# Altium schematic sheet Общая схем лист 1.SchDoc
size 420 x 297 mm; SheetNumber: 1; SheetTotal: 5
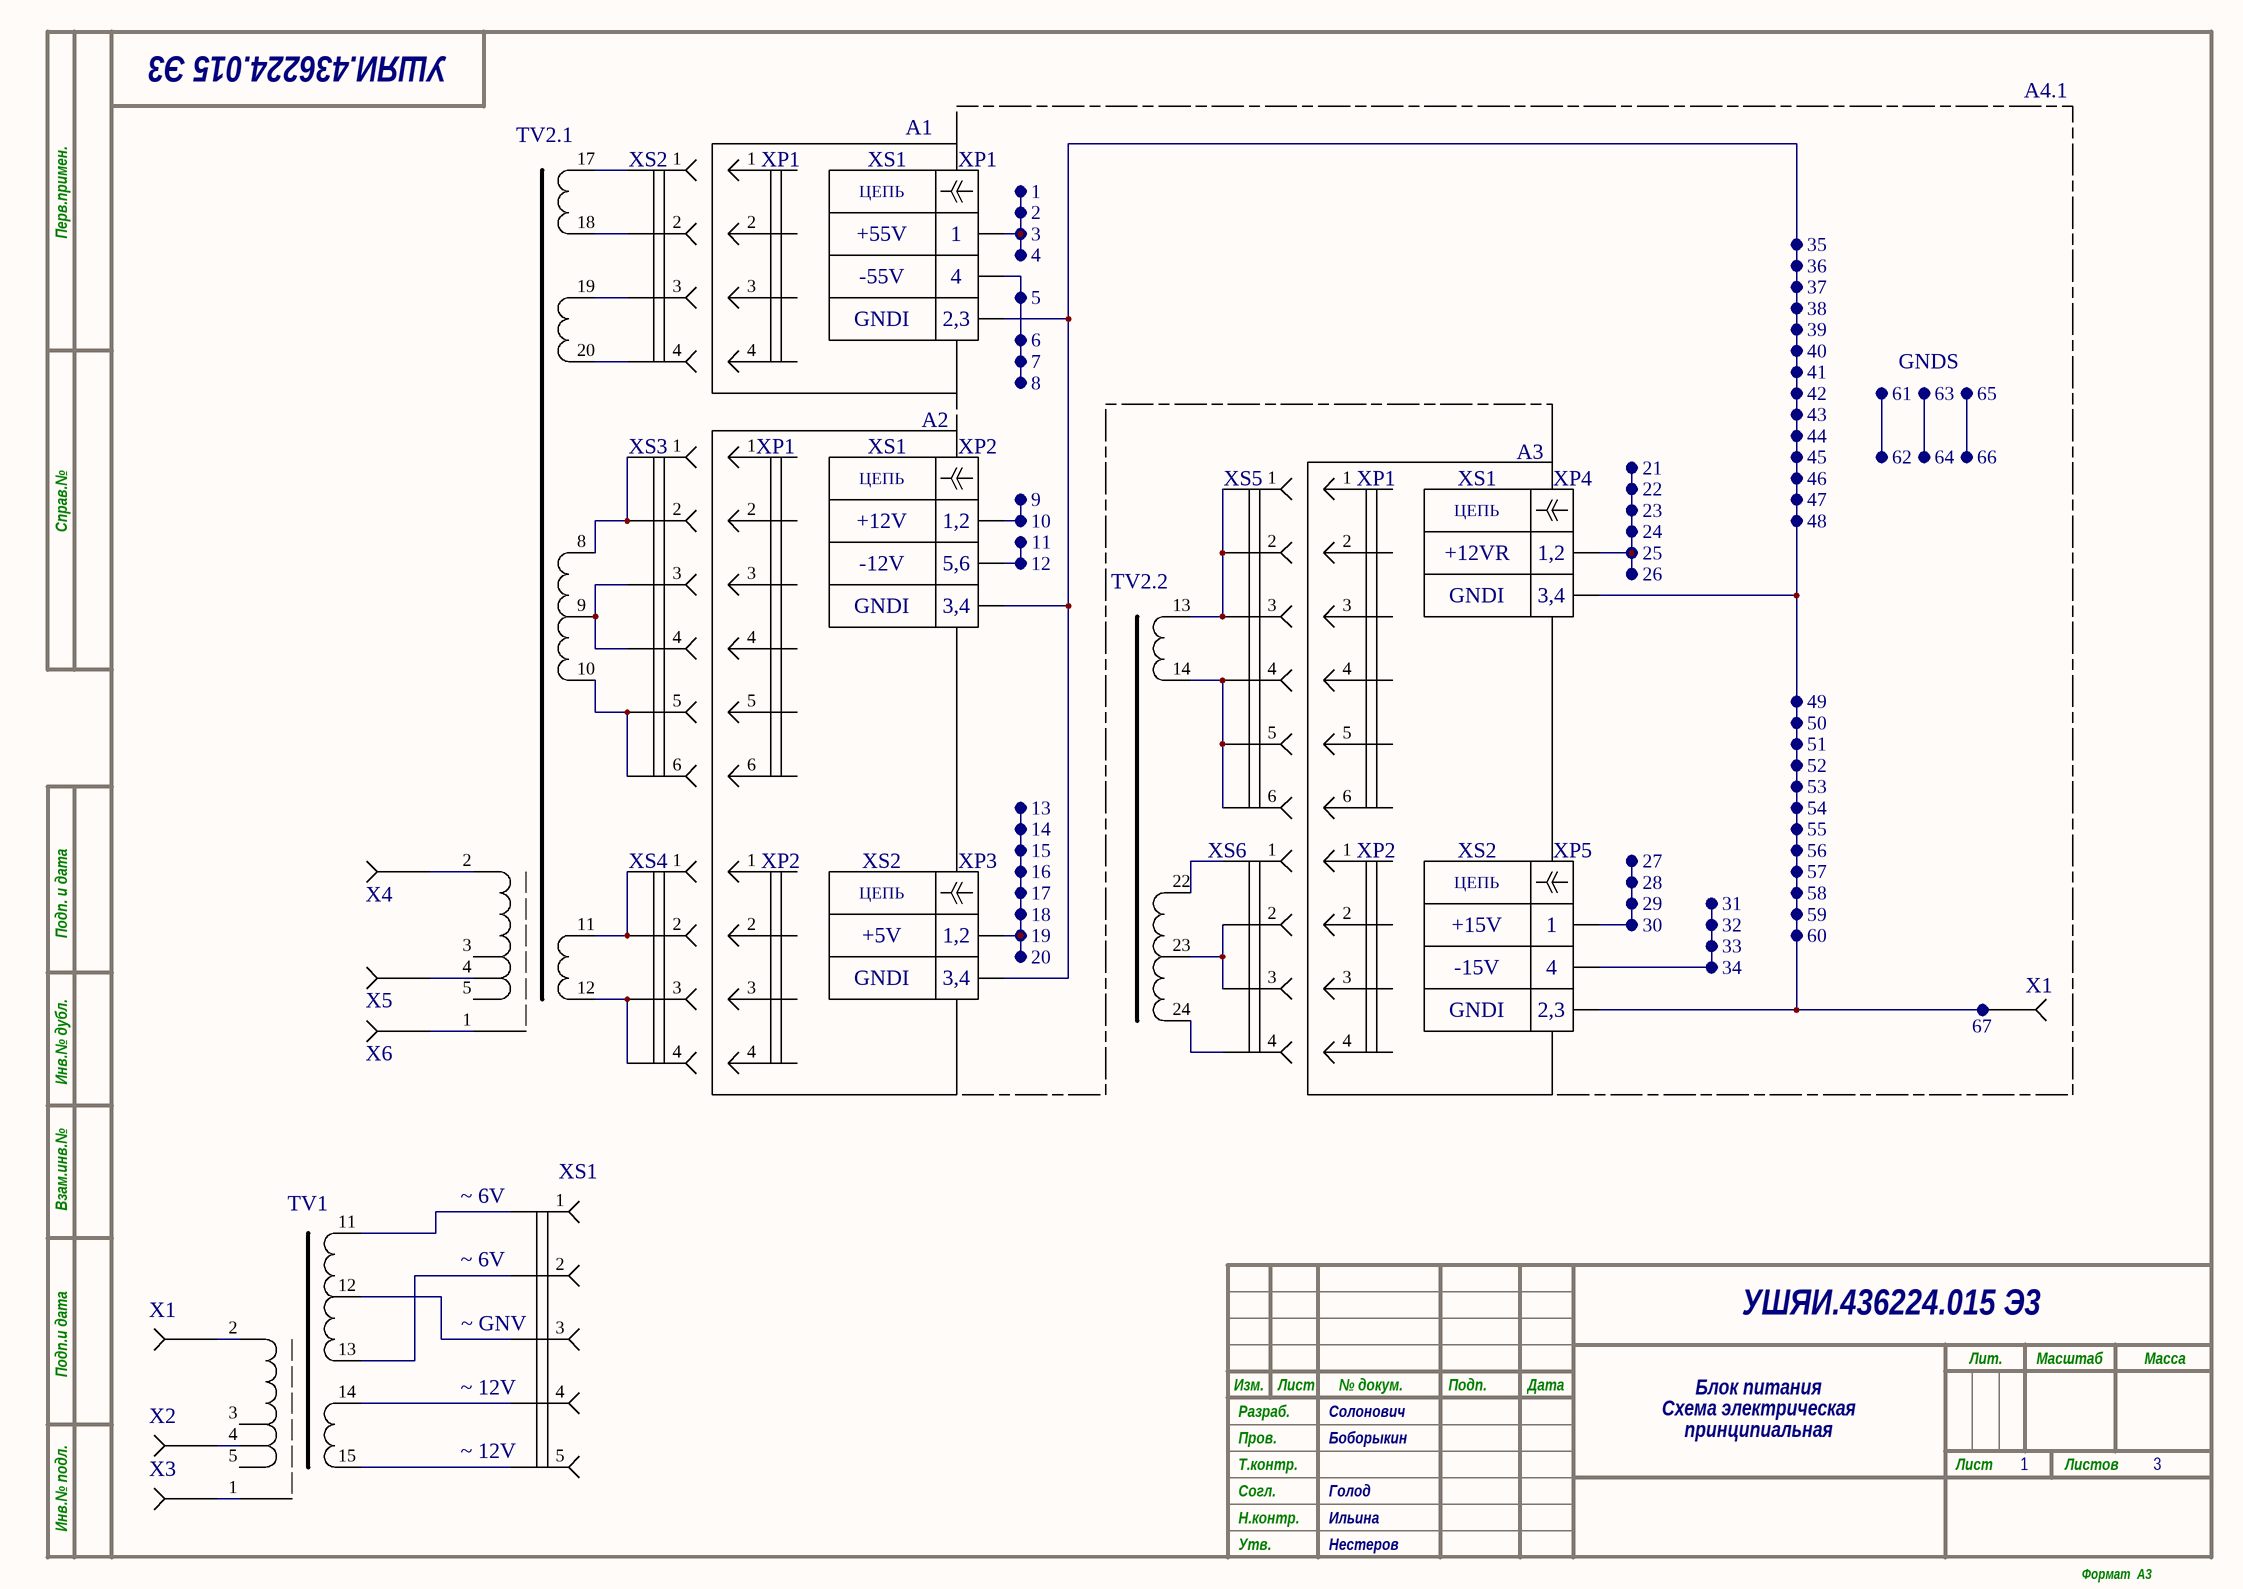
[diagram p0: Общая схем лист 1.SchDoc]

## Parts
(Parts that share a designator on the sheet are numbered #1, #2 ... from top to bottom, then left to right.)
TV1  Трансформатор 1  (value not drawn)
TV2.1  Трансформатор 2  (value not drawn)
TV2.2  Трансформатор 3  (value not drawn)
X1#1  Розетка 1 пин  (value not drawn)
X1#2  Розетка 1 пин  (value not drawn)
X2  Розетка 1 пин  (value not drawn)
X3  Розетка 1 пин  (value not drawn)
X4  Розетка 1 пин  (value not drawn)
X5  Розетка 1 пин  (value not drawn)
X6  Розетка 1 пин  (value not drawn)
XP1#1  Вилка 4 пин  (value not drawn)
XP1#2  Вилка 6 пин  (value not drawn)
XP1#3  Вилка 6 пин  (value not drawn)
XP2#1  Вилка 4 пин  (value not drawn)
XP2#2  Вилка 4 пин  (value not drawn)
XS1#1  +55V  (value not drawn)
XS1#2  +12V  (value not drawn)
XS1#3  +12VR  (value not drawn)
XS1#4  Розетка 1  (value not drawn)
XS2#1  Розетка 4 пин  (value not drawn)
XS2#2  +15V  (value not drawn)
XS2#3  +5V  (value not drawn)
XS3  Розетка 6 пин  (value not drawn)
XS4  Розетка 4 пин  (value not drawn)
XS5  Розетка 6 пин  (value not drawn)
XS6  Розетка 4 пин  (value not drawn)

## Nets
NetTV1_1: TV1.1 X3.1
NetTV1_2: TV1.2 X1#2.1
NetTV1_4: TV1.4 X2.1
NetTV1_11: TV1.11 XS1#4.1
NetTV1_12: TV1.12 XS1#4.3
NetTV1_13: TV1.13 XS1#4.2
NetTV1_14: TV1.14 XS1#4.4
NetTV1_15: TV1.15 XS1#4.5
NetTV2.1_1: TV2.1.1 X6.1
NetTV2.1_2: TV2.1.2 X4.1
NetTV2.1_4: TV2.1.4 X5.1
NetTV2.1_8: TV2.1.8 XS3.1 XS3.2
NetTV2.1_9: TV2.1.9 XS3.3 XS3.4
NetTV2.1_10: TV2.1.10 XS3.5 XS3.6
NetTV2.1_11: TV2.1.11 XS4.1 XS4.2
NetTV2.1_12: TV2.1.12 XS4.3 XS4.4
NetTV2.1_17: TV2.1.17 XS2#1.1
NetTV2.1_18: TV2.1.18 XS2#1.2
NetTV2.1_19: TV2.1.19 XS2#1.3
NetTV2.1_20: TV2.1.20 XS2#1.4
NetTV2.2_13: TV2.2.13 XS5.1 XS5.2 XS5.3
NetTV2.2_14: TV2.2.14 XS5.4 XS5.5 XS5.6
NetTV2.2_22: TV2.2.22 XS6.1
NetTV2.2_23: TV2.2.23 XS6.2 XS6.3
NetTV2.2_24: TV2.2.24 XS6.4
NetX1#1_1: X1#1.1 XS1#1.3 XS1#2.3 XS1#3.2 XS2#2.3 XS2#3.3

Not connected (* = marked no-connect by the designer): TV1 3 5; TV2.1 3 5; XP1#1 1 2 3 4; XP1#2 1 2 3 4 5 6; XP1#3 1 2 3 4 5 6; XP2#1 1 2 3 4; XP2#2 1 2 3 4; XS1#1 1 2; XS1#2 1 2; XS1#3 1; XS2#2 1 2; XS2#3 2

## Notes on the sheet
- УШЯИ.436224.015 Э3
- A1
- A4.1
- XP1
- 1
- (near XS1#1) 4
- (near XS1#1) 3
- 2
- 36
- 35
- (near XS1#1) 5
- 37
- 38
- 39
- 6
- 7
- 8
- 42
- 41
- 40
- 61
- GNDS
- 63
- 65
- A2
- XP2
- A3
- 21
- 45
- 43
- 44
- 62
- 64
- 66
- 9
- 10
- XP4
- 24
- 23
- 22
- 47
- 48
- 46
- 11
- 12
- 25
- 26
- 50
- 49
- 52
- 53
- 51
- XP3
- 16
- 13
- 14
- 15
- XP5
- 27
- 57
- 56
- 55
- 54
- 18
- 19
- 17
- 30
- 29
- 28
- 32
- 31
- 58
- 60
- 59
- 20
- 33
- 34
- (near X1#1) 67
- (near XS1#4) ~ 6V
- (near XS1#4) ~ GNV
- (near XS1#4) ~ 12V
- Солонович
- Блок питания
- Схема электрическая
- Боборыкин
- принципиальная
- 3
- Голод
- Нестеров
- Ильина
- Перв.примен.
- Справ.№
- Подп. и дата
- Инв.№ дубл.
- Взам.инв.№
- Подп.и дата
- Разраб.
- Изм.
- Лист
- № докум.
- Подп.
- Дата
- Лит.
- Масштаб
- Масса
- Т.контр.
- Пров.
- Листов
- Инв.№ подл.
- Утв.
- Н.контр.
- Согл.
- Формат  A3
- (in symbol +5V) ЦЕПЬ; 1,2; GNDI; 3,4
- (in symbol +12V) ЦЕПЬ; 1,2; -12V; 5,6; GNDI; 3,4
- (in symbol +12VR) ЦЕПЬ; 1,2; GNDI; 3,4
- (in symbol +15V) ЦЕПЬ; -15V; 4; GNDI; 2,3
- (in symbol +55V) ЦЕПЬ; -55V; 4; GNDI; 2,3